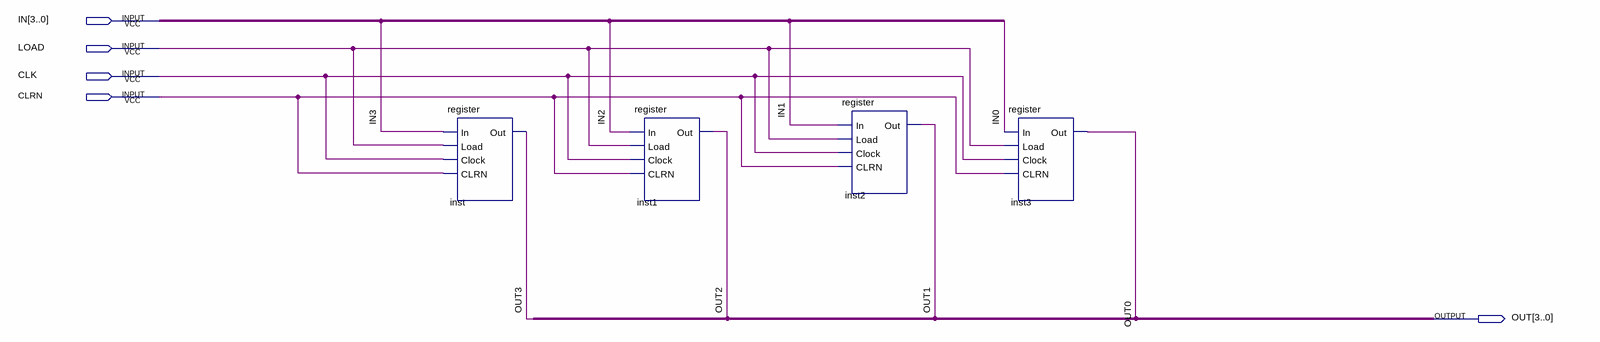
[diagram p0: schematic sheet]
// Quartus schematic reg4b.bdf as structural Verilog: 4 symbols, 5 pins
module reg4b (
  input  [3:0] IN,
  input  LOAD,
  input  CLK,
  input  CLRN,
  output [3:0] OUT
);

  register inst (.In(IN[3]), .Load(LOAD), .Clock(CLK), .CLRN(CLRN), .Out(OUT[3]));
  register inst1 (.In(IN[2]), .Load(LOAD), .Clock(CLK), .CLRN(CLRN), .Out(OUT[2]));
  register inst2 (.In(IN[1]), .Load(LOAD), .Clock(CLK), .CLRN(CLRN), .Out(OUT[1]));
  register inst3 (.In(IN[0]), .Load(LOAD), .Clock(CLK), .CLRN(CLRN), .Out(OUT[0]));
endmodule
